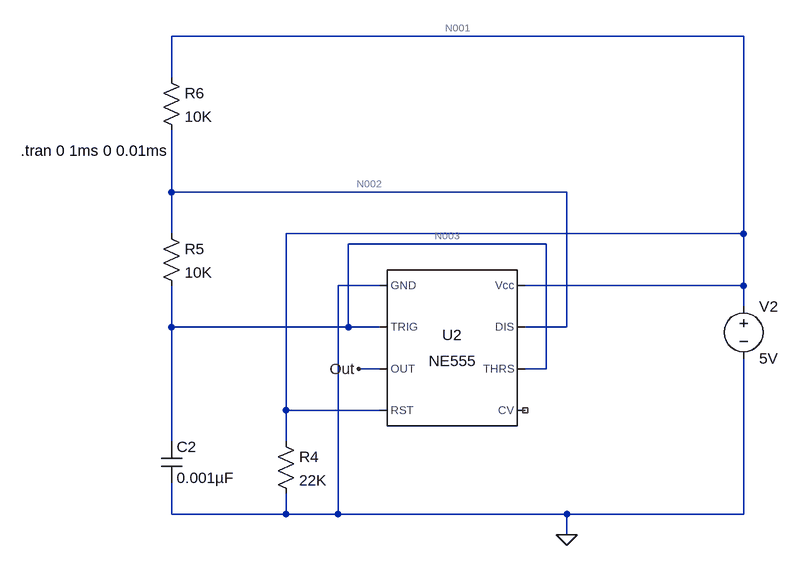
[diagram p0: schematic 555_simulation.asc]
555_simulation.asc, the LTspice schematic file:
Version 4
SHEET 1 880 680
WIRE -672 -320 -1552 -320
WIRE -1552 -256 -1552 -320
WIRE -1552 -80 -1552 -176
WIRE -944 -80 -1552 -80
WIRE -1552 -16 -1552 -80
WIRE -672 -16 -672 -320
WIRE -672 -16 -1376 -16
WIRE -976 0 -1280 0
WIRE -1232 64 -1296 64
WIRE -672 64 -672 -16
WIRE -672 64 -1008 64
WIRE -672 96 -672 64
WIRE -1552 128 -1552 64
WIRE -1280 128 -1280 0
WIRE -1280 128 -1552 128
WIRE -1232 128 -1280 128
WIRE -944 128 -944 -80
WIRE -944 128 -1008 128
WIRE -1232 192 -1264 192
WIRE -976 192 -976 0
WIRE -976 192 -1008 192
WIRE -1376 256 -1376 -16
WIRE -1232 256 -1376 256
WIRE -1552 304 -1552 128
WIRE -1376 304 -1376 256
WIRE -1552 416 -1552 368
WIRE -1376 416 -1376 384
WIRE -1376 416 -1552 416
WIRE -1296 416 -1296 64
WIRE -1296 416 -1376 416
WIRE -944 416 -1296 416
WIRE -672 416 -672 176
WIRE -672 416 -944 416
WIRE -944 448 -944 416
FLAG -944 448 0
FLAG -1264 192 Out
SYMBOL Misc\\NE555 -1120 160 R0
SYMATTR InstName U2
SYMBOL voltage -672 80 R0
SYMATTR InstName V2
SYMATTR Value 5V
SYMBOL res -1392 288 R0
SYMATTR InstName R4
SYMATTR Value 22K
SYMBOL cap -1568 304 R0
SYMATTR InstName C2
SYMATTR Value 0.001µF
SYMBOL res -1568 -32 R0
SYMATTR InstName R5
SYMATTR Value 10K
SYMBOL res -1568 -272 R0
SYMATTR InstName R6
SYMATTR Value 10K
TEXT -1784 -144 Left 2 !.tran 0 1ms 0 0.01ms

The netlist it stands for:
* 555_simulation.asc
XU2 0 N003 Out N001 NC_01 N003 N002 N001 NE555  ; pins GND TRIG OUT RST CV THRS DIS Vcc
V2 N001 0 5V
R4 N001 0 22K
C2 N003 0 0.001µF
R5 N002 N003 10K
R6 N001 N002 10K
.tran 0 1ms 0 0.01ms
.lib NE555.sub
.backanno
.end

* Results of the author's LTspice run, read from the files saved beside the schematic
* Operating Point, zero values left out:
*   V(n003) = 5 V
*   V(n001) = 5 V
*   V(n002) = 5 V
*   V(out) = 5 V
*   I(R6) = 16.67 nA
*   I(R5) = 9.999 nA
*   I(R4) = 227.3 µA
*   I(V2) = -1.838 mA
*   Ix(u2:1) = -1.611 mA
*   Ix(u2:2) = 5 nA
*   Ix(u2:4) = 22.67 µA
*   Ix(u2:6) = 5 nA
*   Ix(u2:7) = 6.671 nA
*   Ix(u2:8) = 1.588 mA
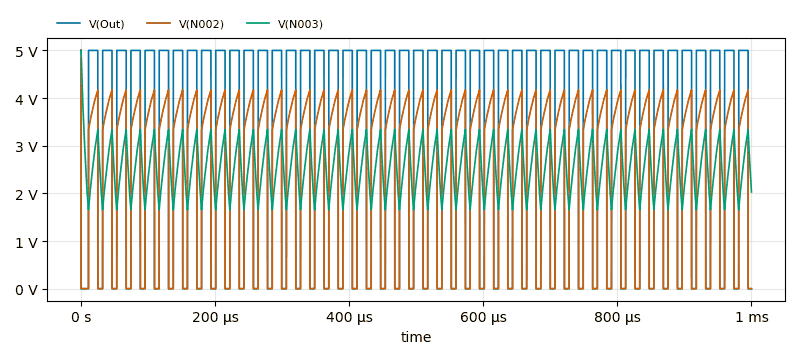
[diagram p1: Transient Analysis of 555_simulation.asc, plotted from the saved traces]
* Transient Analysis, 1 run:
*   V(Out): min 30 µV, max 5 V, average 3.287 V, rms 4.053 V, last 30 µV
*   V(N002): min 3.99 mV, max 5 V, average 2.506 V, rms 3.088 V, last 4.213 mV
*   V(N003): min 1.655 V, max 5 V, average 2.535 V, rms 2.591 V, last 2.029 V